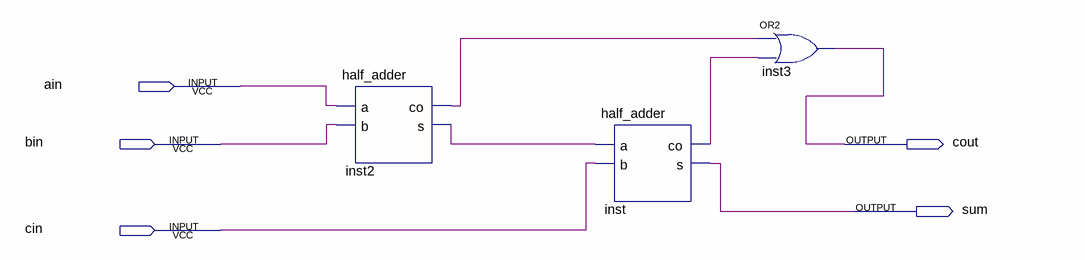
[diagram p0: schematic sheet]
// Quartus schematic full_adder.bdf as structural Verilog: 3 symbols, 5 pins
module full_adder (
  input  ain,
  input  bin,
  input  cin,
  output cout,
  output sum
);

  wire inst2_co, inst2_s, inst_co;

  half_adder inst2 (.a(ain), .b(bin), .co(inst2_co), .s(inst2_s));
  half_adder inst (.a(inst2_s), .b(cin), .co(inst_co), .s(sum));
  or inst3 (cout, inst2_co, inst_co);
endmodule
